# Altium schematic sheet Sheet1.SchDoc
size A2; SheetNumber: 1; SheetTotal: 1
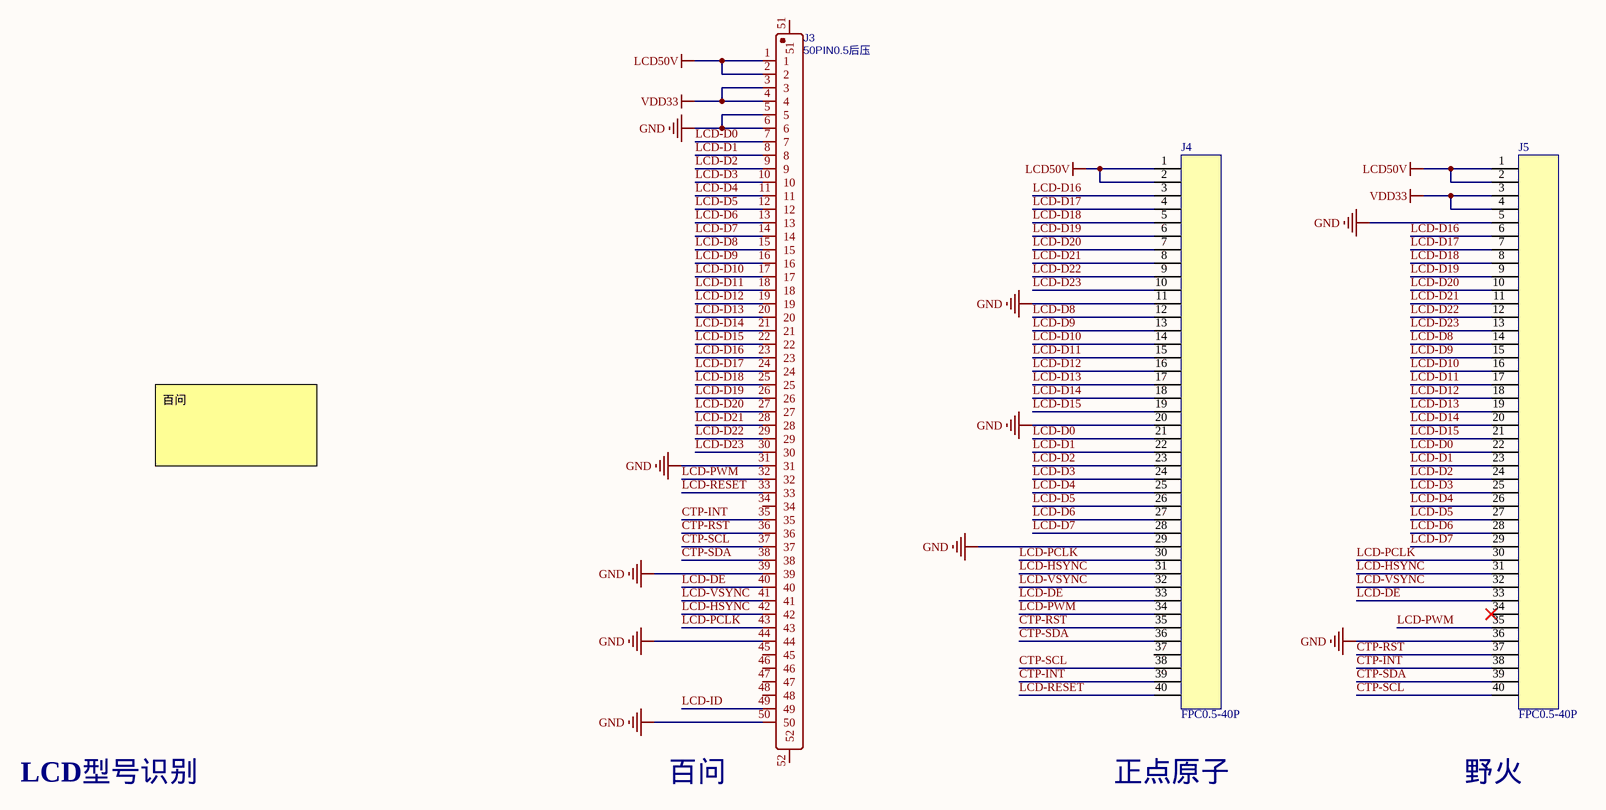
[diagram p0: Sheet1.SchDoc]

## Parts
J3  50PIN0.5后压  [FPC-SMD_KH-FG0.5-H2.0-50PIN]
J4  FPC0.5-40P  [FPC0.5-40P]
J5  FPC0.5-40P  [FPC0.5-40P]

## Nets
GND: J3.5 J3.6 J3.31 J3.39 J3.44 J3.50 J4.11 J4.20 J4.29 J5.5 J5.36
LCD50V: J3.1 J3.2 J4.1 J4.2 J5.1 J5.2
VDD33: J3.3 J3.4 J5.3 J5.4
CTP-INT: J3.35 J4.39 J5.38
CTP-RST: J3.36 J4.35 J5.37
CTP-SCL: J3.37 J4.38 J5.40
CTP-SDA: J3.38 J4.36 J5.39
LCD-D0: J3.7 J4.21 J5.22
LCD-D1: J3.8 J4.22 J5.23
LCD-D2: J3.9 J4.23 J5.24
LCD-D3: J3.10 J4.24 J5.25
LCD-D4: J3.11 J4.25 J5.26
LCD-D5: J3.12 J4.26 J5.27
LCD-D6: J3.13 J4.27 J5.28
LCD-D7: J3.14 J4.28 J5.29
LCD-D8: J3.15 J4.12 J5.14
LCD-D9: J3.16 J4.13 J5.15
LCD-D10: J3.17 J4.14 J5.16
LCD-D11: J3.18 J4.15 J5.17
LCD-D12: J3.19 J4.16 J5.18
LCD-D13: J3.20 J4.17 J5.19
LCD-D14: J3.21 J4.18 J5.20
LCD-D15: J3.22 J4.19 J5.21
LCD-D16: J3.23 J4.3 J5.6
LCD-D17: J3.24 J4.4 J5.7
LCD-D18: J3.25 J4.5 J5.8
LCD-D19: J3.26 J4.6 J5.9
LCD-D20: J3.27 J4.7 J5.10
LCD-D21: J3.28 J4.8 J5.11
LCD-D22: J3.29 J4.9 J5.12
LCD-D23: J3.30 J4.10 J5.13
LCD-DE: J3.40 J4.33 J5.33
LCD-HSYNC: J3.42 J4.31 J5.31
LCD-ID: J3.49
LCD-PCLK: J3.43 J4.30 J5.30
LCD-PWM: J3.32 J4.34 J5.35
LCD-RESET: J3.33 J4.40
LCD-VSYNC: J3.41 J4.32 J5.32

Not connected (* = marked no-connect by the designer): J3 34 45 46 47 48 51 52; J4 37; J5 34*

## Notes on the sheet
- 百问
- LCD型号识别
- 正点原子
- 野火

## Library data of the parts
J3 = 50PIN0.5后压: BOM_Manufacturer: null; Contributor: LCSC; BOM_Supplier: LCSC; BOM_Supplier Part: C9900011403; BOM_Manufacturer Part: 50PIN0.5后压; BOM_JLCPCB Part Class: Extended Part; spicePre: C; spiceSymbolName: 50PIN0.5后压
J4 J5 = FPC0.5-40P: 贴片